# Altium project mimosa_simple_button.PrjPcb
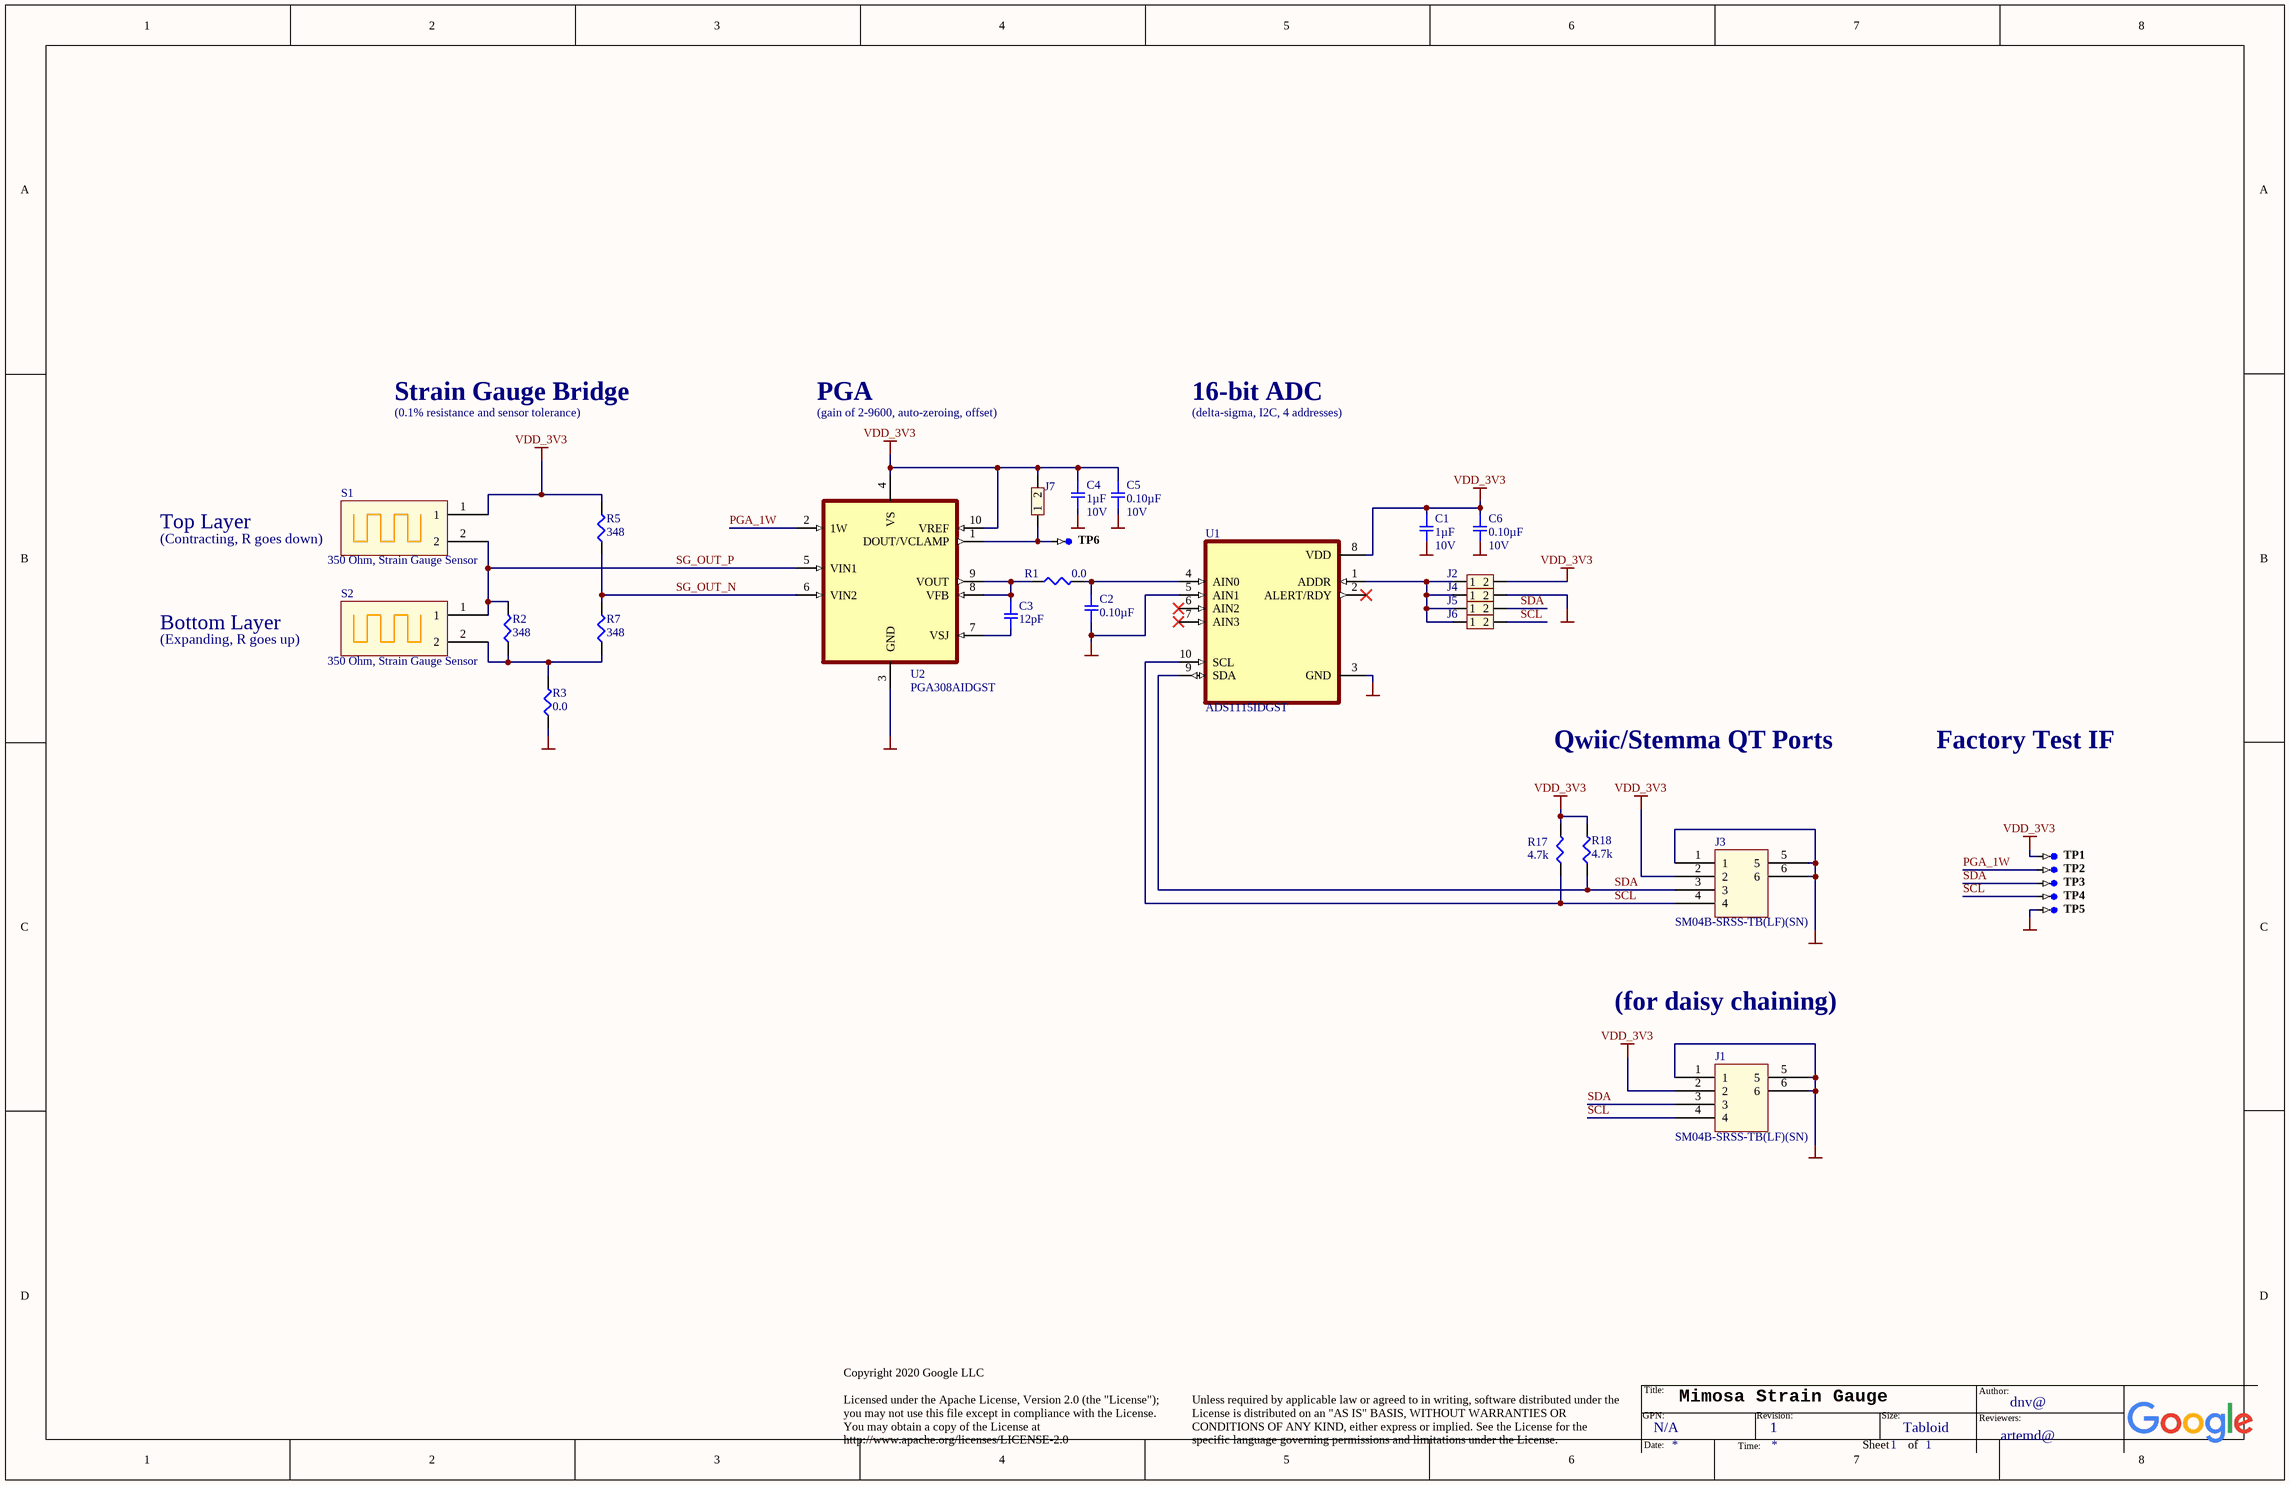
[diagram p0: mimosa_simple_button.SchDoc]
1 sheet, 30 parts. Net scope: global (net labels, ports and power ports of the same name join across sheets).
Board file: mimosa_simple_button.PcbDoc

## Sheet mimosa_simple_button.SchDoc: Mimosa Strain Gauge
size Tabloid; CheckedBy: artemd@; Author: dnv@; DrawnBy: dnv; Organization: Altium Limited; Address1: 1600 Amphitheatre Pkwy, Mountain View CA 94043; DocumentNumber: N/A; Revision: 1; SheetNumber: 1; SheetTotal: 1

### Parts
C1  1µF  Voltage: 10V  [SMD-0402C]
C2  0.10µF  [SMD-0402C]
C3  12pF  [SMD-0402C]
C4  1µF  Voltage: 10V  [SMD-0402C]
C5  0.10µF  Voltage: 10V  [SMD-0402C]
C6  0.10µF  Voltage: 10V  [SMD-0402C]
J1  SM04B-SRSS-TB(LF)(SN)  [4208]
J2  solder bridge jumper, open  [JUMPER1P5MMX1P5MM_OPEN]  (value not drawn)
J3  SM04B-SRSS-TB(LF)(SN)  [4208]
J4  solder bridge jumper, open  [JUMPER1P5MMX1P5MM_OPEN]  (value not drawn)
J5  solder bridge jumper, open  [JUMPER1P5MMX1P5MM_OPEN]  (value not drawn)
J6  solder bridge jumper, open  [JUMPER1P5MMX1P5MM_OPEN]  (value not drawn)
J7  solder bridge jumper, open  [JUMPER1P5MMX1P5MM_OPEN]  (value not drawn)
R1  0.0  [SMD-0402-RES]
R2  348  [SMD-0402-RES]
R3  0.0  [SMD-0402-RES]
R5  348  [SMD-0402-RES]
R7  348  [SMD-0402-RES]
R17  4.7k  [SMD-0402-RES]
R18  4.7k  [SMD-0402-RES]
S1  350 Ohm, Strain Gauge Sensor  [BF350-3AA-NARROW]
S2  350 Ohm, Strain Gauge Sensor  [BF350-3AA-NARROW]
TP1  TP-SM-C-100  [TP-SM-C-100]  (value not drawn)  (no BOM)
TP2  TP-SM-C-100  [TP-SM-C-100]  (value not drawn)  (no BOM)
TP3  TP-SM-C-100  [TP-SM-C-100]  (value not drawn)  (no BOM)
TP4  TP-SM-C-100  [TP-SM-C-100]  (value not drawn)  (no BOM)
TP5  TP-SM-C-100  [TP-SM-C-100]  (value not drawn)  (no BOM)
TP6  TP-SM-C-100  [TP-SM-C-100]  (value not drawn)  (no BOM)
U1  ADS1115IDGST  [SOP50P490X110-10N]
U2  PGA308AIDGST  [SOP50P490X110-10N]

### Nets
GND: C1.2 C2.1 C4.2 C5.2 C6.2 J1.1 J1.5 J1.6 J3.1 J3.5 J3.6 J4.2 R3.1 TP5.1 U1.3(GND) U1.5(AIN1) U2.3(GND)
VDD_3V3: C1.1 C4.1 C5.1 C6.1 J1.2 J2.2 J3.2 J7.2 R5.2 R17.2 R18.2 S1.1 TP1.1 U1.8(VDD) U2.4(VS) U2.10(VREF)
PGA_1W: TP2.1 U2.2(1W)
SCL: J1.4 J3.4 J6.2 R17.1 TP4.1 U1.10(SCL)
SDA: J1.3 J3.3 J5.2 R18.1 TP3.1 U1.9(SDA)
SG_OUT_N: R5.1 R7.2 U2.6(VIN2)
SG_OUT_P: R2.2 S1.2 S2.1 U2.5(VIN1)
NetC2_2: C2.2 R1.2 U1.4(AIN0)
NetC3_1: C3.1 R1.1 U2.8(VFB) U2.9(VOUT)
NetC3_2: C3.2 U2.7(VSJ)
NetJ2_1: J2.1 J4.1 J5.1 J6.1 U1.1(ADDR)
NetJ7_1: J7.1 TP6.1 U2.1(DOUT/VCLAMP)
NetR2_1: R2.1 R3.2 R7.1 S2.2

Not connected (* = marked no-connect by the designer): U1 2(ALERT/RDY)* 6(AIN2)* 7(AIN3)*

### Notes on the sheet
- Strain Gauge Bridge
- (0.1% resistance and sensor tolerance)
- PGA
- (gain of 2-9600, auto-zeroing, offset)
- 16-bit ADC
- (delta-sigma, I2C, 4 addresses)
- Top Layer
- (Contracting, R goes down)
- Bottom Layer
- (Expanding, R goes up)
- Qwiic/Stemma QT Ports
- Factory Test IF
- (for daisy chaining)
- Copyright 2020 Google LLC
  Licensed under the Apache License, Version 2.0 (the "License");
  you may not use this file except in compliance with the License.
  You may obtain a copy of the License at
  http://www.apache.org/licenses/LICENSE-2.0
- Unless required by applicable law or agreed to in writing, software distributed under the License is distributed on an "AS IS" BASIS, WITHOUT WARRANTIES OR CONDITIONS OF ANY KIND, either express or implied. See the License for the specific language governing permissions and limitations under the License.
- GPN:
- Title:
- Revision:
- Size:
- Tabloid
- Author:
- Reviewers:
- Date:
- Time:
- Sheet
- of

### Library data of the parts
C1 C4 = GRM155R61A105KE15D: CAP CER 1UF 10V X5R 0402; Manufacturer: Murata Electronics North America; Factory Stock: 0; Unit Price (USD): 0.1; Minimum Quantity: 1; Tolerance: ±10%; Datasheets: http://www.murata.com/~/media/webrenewal/support/library/catalog/products/capacitor/mlcc/c02e.pdf; Image: //media.digikey.com/Renders/Murata%20Renders/ZRB-SERIES-0402.jpg; Digi-Key Part Number: 490-3890-1-ND; Part Number: GRM155R61A105KE15D; Quantity Available: 6162668; @ qty: 0; Packaging: Cut Tape (CT); Series: GRM; Part Status: Active; Value: 1µF; Temperature Coefficient: X5R; Operating Temperature: -55°C ~ 85°C; Features: -; Ratings: -; Applications: General Purpose; Mounting Type: Surface Mount, MLCC; Package / Case: 0402 (1005 Metric); Size / Dimension: 0.039" L x 0.020" W (1.00mm x 0.50mm); Height - Seated (Max): -; Thickness (Max): 0.022" (0.55mm); Lead Spacing: -; Lead Style: -
C2 = GCM155R71C104KA55D: CAP CER 0.1UF 16V X7R 0402; Manufacturer: Murata Electronics North America; Factory Stock: 0; Unit Price (USD): 0.1; Minimum Quantity: 1; Tolerance: ±10%; Datasheets: http://www.murata.com/~/media/webrenewal/support/library/catalog/products/capacitor/mlcc/c03e.ashx; Image: //media.digikey.com/Renders/Murata%20Renders/ZRB-SERIES-0402.jpg; Digi-Key Part Number: 490-4759-1-ND; Part Number: GCM155R71C104KA55D; Quantity Available: 734194; @ qty: 0; Packaging: Cut Tape (CT); Series: GCM; Part Status: Active; Value: 0.10µF; Voltage: 16V; Temperature Coefficient: X7R; Operating Temperature: -55°C ~ 125°C; Features: -; Ratings: AEC-Q200; Applications: Automotive; Mounting Type: Surface Mount, MLCC; Package / Case: 0402 (1005 Metric); Size / Dimension: 0.039" L x 0.020" W (1.00mm x 0.50mm); Height - Seated (Max): -; Thickness (Max): 0.022" (0.55mm); Lead Spacing: -; Lead Style: -
C3 = GCM1555C1H120JA16D: CAP CER 12PF 50V NP0 0402; Manufacturer: Murata Electronics North America; Factory Stock: 0; Unit Price (USD): 0.1; Minimum Quantity: 1; Tolerance: ±5%; Temperature Coefficient: C0G, NP0; Datasheets: http://www.murata.com/~/media/webrenewal/support/library/catalog/products/capacitor/mlcc/c03e.ashx; Image: //media.digikey.com/Renders/Murata%20Renders/ZRB-SERIES-0402.jpg; Digi-Key Part Number: 490-12649-1-ND; Part Number: GCM1555C1H120JA16D; Quantity Available: 29045; @ qty: 0; Packaging: Cut Tape (CT); Series: GCM; Part Status: Active; Value: 12pF; Voltage: 50V; Operating Temperature: -55°C ~ 125°C; Features: -; Ratings: AEC-Q200; Applications: Automotive; Mounting Type: Surface Mount, MLCC; Package / Case: 0402 (1005 Metric); Size / Dimension: 0.039" L x 0.020" W (1.00mm x 0.50mm); Height - Seated (Max): -; Thickness (Max): 0.022" (0.55mm); Lead Spacing: -; Lead Style: -
C5 C6 = GRM152R61A104KE19D: CAP CER 0.1UF 10V X5R 0402; Manufacturer: Murata Electronics North America; Factory Stock: 0; Unit Price (USD): 0.16; Minimum Quantity: 1; Tolerance: ±10%; Datasheets: http://www.murata.com/~/media/webrenewal/support/library/catalog/products/capacitor/mlcc/c02e.pdf; Image: //media.digikey.com/Renders/Murata%20Renders/ZRB-SERIES-0402.jpg; Digi-Key Part Number: 490-10008-1-ND; Part Number: GRM152R61A104KE19D; Quantity Available: 80241; @ qty: 0; Packaging: Cut Tape (CT); Series: GRM; Part Status: Active; Value: 0.10µF; Temperature Coefficient: X5R; Operating Temperature: -55°C ~ 85°C; Features: Derating Recommended; Ratings: -; Applications: General Purpose; Mounting Type: Surface Mount, MLCC; Package / Case: 0402 (1005 Metric); Size / Dimension: 0.039" L x 0.020" W (1.00mm x 0.50mm); Height - Seated (Max): -; Thickness (Max): 0.009" (0.22mm); Lead Spacing: -; Lead Style: -
J1 J3 = 4208
J2 J4-J7 = jumper_open
R1 R3 = ERJ-2GE0R00X: RES SMD 0.0OHM JUMPER 1/10W 0402; Manufacturer: Panasonic Electronic Components; Factory Stock: 0; Unit Price (USD): 0.00384; @ qty: 1500; Minimum Quantity: 1; Power (Watts): 0.1W, 1/10W; Part Number: ERJ-2GE0R00X; Datasheets: http://industrial.panasonic.com/www-cgi/jvcr13pz.cgi?E+PZ+3+AOA0001+ERJ2GE0R00X+7+WW; Image: //media.digikey.com/Photos/Panasonic%20Photos/ERJ-PA2-Series.jpg; Digi-Key Part Number: P0.0JCT-ND; Quantity Available: 3152483; Packaging: Cut Tape (CT); Series: ERJ; Part Status: Active; Value: 0.0; Tolerance: Jumper; Composition: Thick Film; Features: Automotive AEC-Q200; Temperature Coefficient: -; Operating Temperature: -55°C ~ 155°C; Package / Case: 0402 (1005 Metric); Supplier Device Package: 0402; Size / Dimension: 0.039" L x 0.020" W (1.00mm x 0.50mm); Height - Seated (Max): 0.016" (0.40mm); Number of Terminations: 2; Failure Rate: -
R2 R5 R7 = ERJ-2RKF3480X: RES SMD 348 OHM 1% 1/10W 0402; Manufacturer: Panasonic Electronic Components; Factory Stock: 0; Unit Price (USD): 0.00408; @ qty: 1500; Minimum Quantity: 1; Power (Watts): 0.1W, 1/10W; Temperature Coefficient: ±100ppm/°C; Part Number: ERJ-2RKF3480X; Datasheets: http://industrial.panasonic.com/www-cgi/jvcr13pz.cgi?E+PZ+3+AOA0002+ERJ2RKF3480X+7+WW; Image: //media.digikey.com/Photos/Panasonic%20Photos/ERJ-PA2-Series.jpg; Digi-Key Part Number: P348LCT-ND; Quantity Available: 73385; Packaging: Cut Tape (CT); Series: ERJ; Part Status: Active; Value: 348; Tolerance: ±1%; Composition: Thick Film; Features: Automotive AEC-Q200; Operating Temperature: -55°C ~ 155°C; Package / Case: 0402 (1005 Metric); Supplier Device Package: 0402; Size / Dimension: 0.039" L x 0.020" W (1.00mm x 0.50mm); Height - Seated (Max): 0.016" (0.40mm); Number of Terminations: 2; Failure Rate: -
R17 R18 = ERJ-2GEJ472X: RES SMD 4.7K OHM 5% 1/10W 0402; Manufacturer: Panasonic Electronic Components; Factory Stock: 0; Unit Price (USD): 0.00350; @ qty: 1500; Minimum Quantity: 1; Power (Watts): 0.1W, 1/10W; Temperature Coefficient: ±200ppm/°C; Part Number: ERJ-2GEJ472X; Datasheets: http://industrial.panasonic.com/www-cgi/jvcr13pz.cgi?E+PZ+3+AOA0001+ERJ2GEJ472X+7+WW; Image: //media.digikey.com/Photos/Panasonic%20Photos/ERJ-PA2-Series.jpg; Digi-Key Part Number: P4.7KJCT-ND; Quantity Available: 8551774; Packaging: Cut Tape (CT); Series: ERJ; Part Status: Active; Value: 4.7k; Tolerance: ±5%; Composition: Thick Film; Features: Automotive AEC-Q200; Operating Temperature: -55°C ~ 155°C; Package / Case: 0402 (1005 Metric); Supplier Device Package: 0402; Size / Dimension: 0.039" L x 0.020" W (1.00mm x 0.50mm); Height - Seated (Max): 0.016" (0.40mm); Number of Terminations: 2; Failure Rate: -
S1 S2 = BF350-3AA
TP1-TP6 = CMP-0484-00002-2: Test Point, Surface Mount, Circular, Pad Diameter 1 mm; Manufacturer: No Vendor; Manufacturer 1: ALTIUM; PartNumber: TP-SM-C-100; Manufacturer Part Number 1: TP-SM-C-100; Manufacturer 2: No Vendor; Manufacturer Part Number 2: TP-SM-C-100
U1 = ADS1015IDGST: 12-Bit, 3.3kSPS, 4-Ch Delta-Sigma ADC With PGA, Oscillator, VREF, Comparator and I2C Interface 10-VSSOP -40 to 125; MF: Texas Instruments; Mouser-Purchase-URL: https://snapeda.com/shop?store=Mouser&id=425936; Price: None; Availability: Good; Package: VSSOP-10 Texas Instruments; DigiKey-Purchase-URL: https://snapeda.com/shop?store=DigiKey&id=425936; MP: ADS1015IDGST; Value: *; SnapEDA_Link: https://www.snapeda.com/parts/ADS1015IDGST/Texas%20Instruments/view-part/425936/?ref=snap; Texas_Instruments-Purchase-URL: https://snapeda.com/shop?store=Texas+Instruments&id=425936
U2 = PGA308AIDGST: Package: None; Price: None; Value: *; MP: PGA308AIDGST; Availability: Unavailable

## Assembly variants
Populated: not fitted C1 C2 P1 P2 R7 R13